# EAGLE schematic trigger (EAGLE 9.2.2)
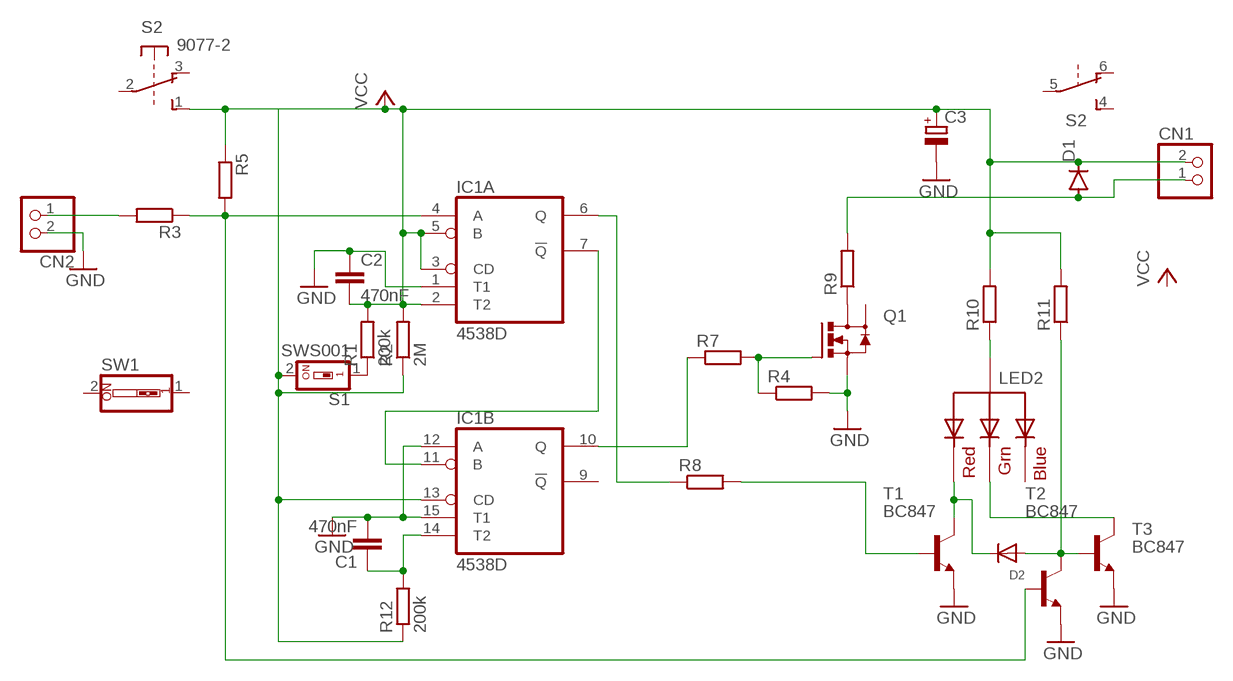
[diagram p0: schematic, sheet 1]

## Parts
C1  470nF  C  [C0805]
C2  470nF  C  [C0805]
C3  CPOL-EUE5-13  [E5-13]
CN1  JST_2PIN-THM  [JST-PH-2-THM]
CN2  JST_2PIN-THM  [JST-PH-2-THM]
D1  DIODE-DO214AC  [DO214AC]
D2  DIODESMA  [SMADIODE]
IC1  4538D  [SO16]
LED2  RGBLED_CA-5MM  [LED5MMRGB]
Q1  MOSFET_N_SOT223  [SOT223]
R1  200k  RR1206  [R1206]
R2  2M  RR1206  [R1206]
R3  RR1206  [R1206]
R4  RR1206  [R1206]
R5  RR1206  [R1206]
R7  RR1206  [R1206]
R8  RR1206  [R1206]
R9  RR1206  [R1206]
R10  R  [R0805]
R11  R  [R0805]
R12  200k  RR1206  [R1206]
S1  SWS001  [SMS-001]
S2  9077-2  [9077-2]
SW1  SW_DIP-1  [EDG-01]
T1  BC847  [SOT23]
T2  BC847  [SOT23]
T3  BC847  [SOT23]

## Nets
GND: C1.2 C2.1 C3.- CN2.2 IC1.1(A:T1) IC1.12(B:A) IC1.15(B:T1) Q1.3(S) R4.2 T1.2(E) T2.2(E) T3.2(E)
N$1: C1.1 IC1.14(B:T2) R12.2
N$2: CN2.1 R3.2
N$3: IC1.4(A:A) R3.1 R5.2 T3.1(B)
N$4: IC1.10(B:Q) R7.1
N$5: Q1.2(D) R9.1
N$6: D2.A R11.1 T2.1(B) T3.3(C)
N$7: CN1.1 D1.A R9.2
N$8: R8.2 T1.1(B)
N$9: LED2.2(VCC) R10.1
N$10: IC1.6(A:Q) R8.1
N$11: LED2.3(GREEN) T2.3(C)
N$12: Q1.1(G) R4.1 R7.2
N$13: IC1.7(A:!Q) IC1.11(B:B)
N$14: R1.1 S1.1
N$15: D2.C LED2.1(RED) T1.3(C)
VCC: C2.2 C3.+ CN1.2 D1.C IC1.2(A:T2) IC1.3(A:CD) IC1.5(A:B) IC1.13(B:CD) R1.2 R2.1 R2.2 R5.1 R10.2 R11.2 R12.1 S1.2 S2.1(1:S)
Unconnected: IC1.9(B:!Q) LED2.4(BLUE) Q1.4(D1) S2.2(1:P) S2.3(1:O) S2.4(2:S) S2.5(2:P) S2.6(2:O) SW1.1 SW1.2

## Power pins joined to a net without a drawn wire
VDD: IC1.16(P:VDD)
VSS: IC1.8(P:VSS)

## Library data of the parts
C1 C2 = eagle-ltspice:C: CAPACITOR, European symbol; SPICEMODEL: NONE; SPICEPREFIX: C
C3 = rcl:CPOL-EU: POLARIZED CAPACITOR, European symbol; SPICEPREFIX: C
CN1 CN2 = adafruit:JST_2PIN: JST 2-Pin Connectors of various flavors SMT-RA (S2B-PH-SM4) 4UConnector #17311 SMT (B2B-PH-SM4) THM-RA (S2B-PH) THM (B2B-PH)
D1 = diode:DIODE-: DIODE
D2 = adafruit:DIODE: Diode SMADIODE - SMA Surface Mount Package 20V 1A Schottky Diode Digikey: 641-1014-6-ND DO-1N4148 - Through Hole Small Current Diode SOD-123 20V 1 A (.5mV Vf) Schottky Diode - Digikey: MBRX120TPMSCT-ND SOD-323 10V 570mA (.38mV Vf, 3ns) Schottky Diode - Digikey: ZLLS410CT-ND SOD-523 30V 30mA Schottky Diode (RB751S-40TE61) - Digikey: RB751S-40TE61CT-ND SOT23-R/W - SOT23 Package (R = Solder Paste/Reflow Ovens, W = Hand-Soldering) BAT54Film 40V 300mA - Digikey: 497-7162-1-ND
IC1 = 45xx:4538: Dual precision monostable MULTIVIBRATOR
LED2 = adafruit:RGBLED_CA: RGB LED, common-anode 5MM Staggered pins 5mm Piranha package http://www.ladyada.net/library/pcb/eaglelibrary.html
Q1 = m-pad-2.1:MOSFET_N_SOT223: n channel mosfets in the sot-223 package standard pinout ie. fairchildsemi.com: IRFL4105 NDT451AN NDT455N FDT439N FQT13N06L etc. digikey: NDT451ANCT-ND (good, cheap one from natsemi)
R1-R5 R7-R12 = eagle-ltspice:R: RESISTOR, European symbol; SPICEMODEL: NONE; SPICEPREFIX: R
S1 = smd-special:SWS001: SMD Dip Switch 1 pol.
S2 = switch-misc:9077-2: MARQUARDT SWITCH 9077.0200 Distributor: Buerklin <https://www.buerklin.com/default.asp?event=ShowArtikel%2812G2822%29&l=d&jump=ArtNr_12G2822>
SW1 = special:SW_DIP-1: DIP SWITCH
T1 T2 = nxp_60:BC847: 45 V, 100 mA NPN general-purpose transistors NPN general-purpose transistor AAL Eindhoven MK
T3 = transistor:BC847: NPN TRANSISTOR